# Altium project CPUBoard-v6.PrjPCB
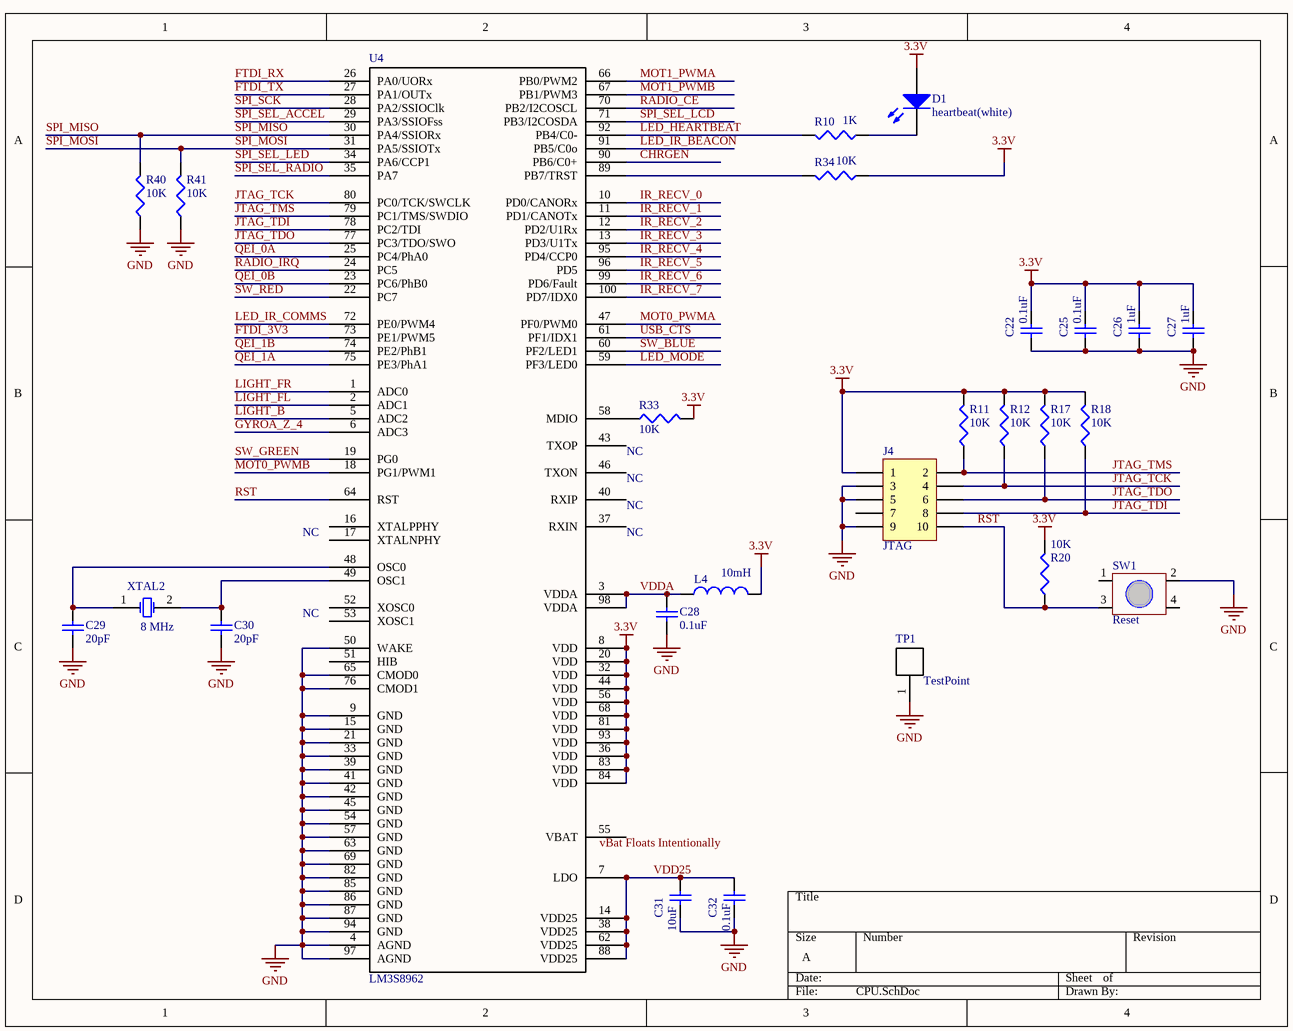
[diagram p0: CPU.SchDoc]
4 sheets, 108 parts. Net scope: global (net labels, ports and power ports of the same name join across sheets).
Board file: cpuPCB-v6.PcbDoc
Sheets:
  CPU.SchDoc
  USB_Headers.SchDoc
  IRComms.SchDoc
  LEDs.SchDoc

## Sheet CPU.SchDoc
size A

### Parts
C22  value 0.1uF  [CAPC1005L]  (hidden comment: Cap Semi)
C25  value 0.1uF  [CAPC1005L]  (hidden comment: Cap Semi)
C26  value 1uF  [CAPC1608L]  (hidden comment: Cap Semi)
C27  value 1uF  [CAPC1608L]  (hidden comment: Cap Semi)
C28  value 0.1uF  [CAPC1005L]  (hidden comment: Cap Semi)
C29  value 20pF  [CAPC1005L]  (hidden comment: Cap Semi)
C30  value 20pF  [CAPC1005L]  (hidden comment: Cap Semi)
C31  value 10uF  [CAPC1608L]  (hidden comment: Cap Semi)
C32  value 0.1uF  [CAPC1005L]  (hidden comment: Cap Semi)
D1  heartbeat(white)  [INDC2012L]
J4  JTAG  [JTAG-10]
L4  value 10mH  [INDC2012L]  (hidden comment: Inductor)
R10  value 1K  [RESC1608L]  (hidden comment: Res3)
R11  value 10K  [RESC1608L]  (hidden comment: Res3)
R12  value 10K  [RESC1608L]  (hidden comment: Res3)
R17  value 10K  [RESC1608L]  (hidden comment: Res3)
R18  value 10K  [RESC1608L]  (hidden comment: Res3)
R20  value 10K  [RESC1608L]  (hidden comment: Res3)
R33  value 10K  [RESC1608L]  (hidden comment: Res3)
R34  value 10K  [RESC1608L]  (hidden comment: Res3)
R40  value 10K  [RESC1608L]  (hidden comment: Res3)
R41  value 10K  [RESC1608L]  (hidden comment: Res3)
SW1  Reset  [SwitchTall-TL330]
TP1  TestPoint  [TestPoint]
U4  LM3S8962  [LQFP-100]
XTAL2  8 MHz  [RESC5025L]

### Nets
3.3V: C22.2 C25.2 C26.2 C27.2 D1.1(A) J4.1 L4.2 R11.2 R12.2 R17.2 R18.2 R20.2 R33.2 R34.1 U4.8(VDD) U4.20(VDD) U4.32(VDD) U4.36(VDD) U4.44(VDD) U4.56(VDD) U4.68(VDD) U4.81(VDD) U4.83(VDD) U4.84(VDD) U4.93(VDD)
GND: C22.1 C25.1 C26.1 C27.1 C28.1 C29.1 C30.1 C31.1 C32.1 J4.3 J4.5 J4.9 R40.1 R41.1 SW1.2 TP1.1 U4.4(AGND) U4.9(GND) U4.15(GND) U4.21(GND) U4.33(GND) U4.39(GND) U4.41(GND) U4.42(GND) U4.45(GND) U4.50(WAKE) U4.54(GND) U4.57(GND) U4.63(GND) U4.65(CMOD0) U4.69(GND) U4.76(CMOD1) U4.82(GND) U4.85(GND) U4.86(GND) U4.87(GND) U4.94(GND) U4.97(AGND)
CHRGEN: U4.90(PB6/C0+)
FTDI_3V3: U4.73(PE1/PWM5)
FTDI_RX: U4.26(PA0/UORx)
FTDI_TX: U4.27(PA1/OUTx)
GYROA_Z_4: U4.6(ADC3)
IR_RECV_0: U4.10(PD0/CANORx)
IR_RECV_1: U4.11(PD1/CANOTx)
IR_RECV_2: U4.12(PD2/U1Rx)
IR_RECV_3: U4.13(PD3/U1Tx)
IR_RECV_4: U4.95(PD4/CCP0)
IR_RECV_5: U4.96(PD5)
IR_RECV_6: U4.99(PD6/Fault)
IR_RECV_7: U4.100(PD7/IDX0)
JTAG_TCK: J4.4 R12.1 U4.80(PC0/TCK/SWCLK)
JTAG_TDI: J4.8 R18.1 U4.78(PC2/TDI)
JTAG_TDO: J4.6 R17.1 U4.77(PC3/TDO/SWO)
JTAG_TMS: J4.2 R11.1 U4.79(PC1/TMS/SWDIO)
LED_HEARTBEAT: R10.2 U4.92(PB4/C0-)
LED_IR_BEACON: U4.91(PB5/C0o)
LED_IR_COMMS: U4.72(PE0/PWM4)
LED_MODE: U4.59(PF3/LED0)
LIGHT_B: U4.5(ADC2)
LIGHT_FL: U4.2(ADC1)
LIGHT_FR: U4.1(ADC0)
MOT0_PWMA: U4.47(PF0/PWM0)
MOT0_PWMB: U4.18(PG1/PWM1)
MOT1_PWMA: U4.66(PB0/PWM2)
MOT1_PWMB: U4.67(PB1/PWM3)
QEI_0A: U4.25(PC4/PhA0)
QEI_0B: U4.23(PC6/PhB0)
QEI_1A: U4.75(PE3/PhA1)
QEI_1B: U4.74(PE2/PhB1)
RADIO_CE: U4.70(PB2/I2COSCL)
RADIO_IRQ: U4.24(PC5)
RST: J4.10 R20.1 SW1.3 U4.64(RST)
SPI_MISO: R40.2 U4.30(PA4/SSIORx)
SPI_MOSI: R41.2 U4.31(PA5/SSIOTx)
SPI_SCK: U4.28(PA2/SSIOClk)
SPI_SEL_ACCEL: U4.29(PA3/SSIOFss)
SPI_SEL_LCD: U4.71(PB3/I2COSDA)
SPI_SEL_LED: U4.34(PA6/CCP1)
SPI_SEL_RADIO: U4.35(PA7)
SW_BLUE: U4.60(PF2/LED1)
SW_GREEN: U4.19(PG0)
SW_RED: U4.22(PC7)
USB_CTS: U4.61(PF1/IDX1)
VDD25: C31.2 C32.2 U4.7(LDO) U4.14(VDD25) U4.38(VDD25) U4.62(VDD25) U4.88(VDD25)
VDDA: C28.2 L4.1 U4.3(VDDA) U4.98(VDDA)
NetC29_2: C29.2 U4.48(OSC0) XTAL2.1(OSC1)
NetC30_2: C30.2 U4.49(OSC1) XTAL2.2(OSC2)
NetD1_2: D1.2(K) R10.1
NetR33_1: R33.1 U4.58(MDIO)
NetR34_2: R34.2 U4.89(PB7/TRST)

Not connected (* = marked no-connect by the designer): J4 7; SW1 1 4; U4 16(XTALPPHY) 17(XTALNPHY) 37(RXIN) 40(RXIP) 43(TXOP) 46(TXON) 51(HIB) 52(XOSC0) 53(XOSC1) 55(VBAT)

### Notes on the sheet
- NC
- (near U4) NC
- (near U4) vBat Floats Intentionally

### Library data of the parts
C22 C25-C32 = Cap Semi: Capacitor (Semiconductor SIM Model); Published: 8-Jun-2000; LatestRevisionDate: 29-May-2009; LatestRevisionNote: IPC-7351 Footprint Added.; PackageReference: C1206; Publisher: Altium Limited; PackageDescription: Chip Capacitor
D1 = LED2: Typical RED, GREEN, YELLOW, AMBER GaAs LED; Published: 8-Jun-2000; LatestRevisionDate: 17-Jul-2002; LatestRevisionNote: Re-released for DXP Platform.; PackageVersion: Feb-2002; PackageReference: 3.2X1.6X1.1; Publisher: Altium Limited
J4 = Header 5X2H: Header, 5-Pin, Dual row, Right Angle; LatestRevisionDate: 17-Jul-2002; LatestRevisionNote: Re-released for DXP Platform.; Publisher: Altium Limited
L4 = Inductor: Code_IEC: 1005; Published: 8-Jun-2000; LatestRevisionDate: 29-May-2009; LatestRevisionNote: IPC-7351 Footprint Added.; PackageReference: 0402-A; Publisher: Altium Limited; PackageDescription: Chip Inductor; Code_JEITA: 0402
R10-R12 R17 R18 R20 R33 R34 R40 R41 = Res3: Resistor; Published: 8-Jun-2000; LatestRevisionDate: 29-May-2009; LatestRevisionNote: IPC-7351 Footprint Added.; PackageReference: J1-0603; Publisher: Altium Limited; PackageDescription: Chip Resistor
SW1 = Switch-TL330
XTAL2 = XTAL: Crystal Oscillator; Published: 8-Jun-2000; LatestRevisionDate: 17-Jul-2002; LatestRevisionNote: Re-released for DXP Platform.; PackageReference: R38; Publisher: Altium Limited

## Sheet USB_Headers.SchDoc
size A
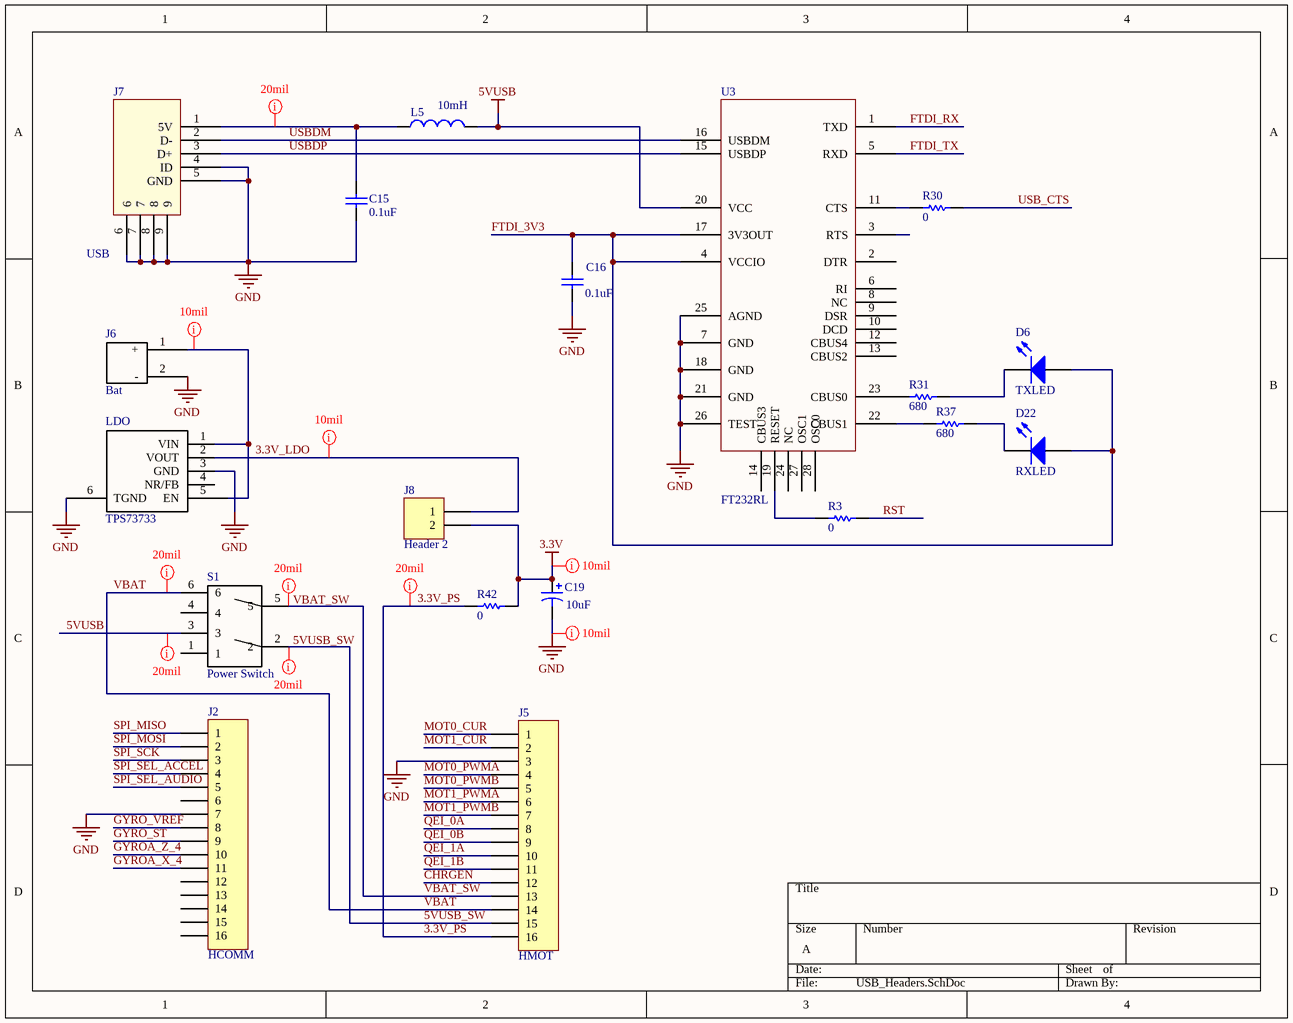
[diagram p1: USB_Headers.SchDoc]

### Parts
C15  value 0.1uF  [CAPC1005L]
C16  value 0.1uF  [CAPC1005L]
C19  value 10uF  [CAPC3216L]  (hidden comment: Cap Pol3)
D6  TXLED  [INDC2012L]
D22  RXLED  [INDC2012L]
J2  HCOMM  [HDR1X16]
J5  HMOT  [HDR1X16]
J6  Bat  [BatteryConnJST]
J7  USB  [USB Minib (thru-hole)]
J8  Header 2  [HDR1X2]
L5  value 10mH  [INDC2012L]  (hidden comment: Inductor)
LDO  TPS73733  [SOT-223-5pin]
R3  value 0  [RESC1608L]
R30  value 0  [RESC1608L]
R31  value 680  [RESC1608L]
R37  value 680  [RESC1608L]
R42  value 0  [RESC3216L]
S1  Power Switch  [DPDTSwitch]
U3  FT232RL  [SSOP-28]

### Nets
3.3V: C19.1 J8.2 R42.2
5VUSB: L5.2 S1.3 U3.20(VCC)
GND: C15.1 C16.1 C19.2 J2.7 J5.3 J6.2(-) J7.4(ID) J7.5(GND) J7.6 J7.7 J7.8 J7.9 LDO.3(GND) LDO.6(TGND) U3.7(GND) U3.18(GND) U3.21(GND) U3.25(AGND) U3.26(TEST)
3.3V_LDO: J8.1 LDO.2(VOUT)
3.3V_PS: J5.16 R42.1
5VUSB_SW: J5.15 S1.2
CHRGEN: J5.12
FTDI_3V3: C16.2 D6.1(A) D22.1(A) U3.4(VCCIO) U3.17(3V3OUT)
FTDI_RX: U3.1(TXD)
FTDI_TX: U3.5(RXD)
GYRO_ST: J2.9
GYRO_VREF: J2.8
GYROA_X_4: J2.11
GYROA_Z_4: J2.10
MOT0_CUR: J5.1
MOT0_PWMA: J5.4
MOT0_PWMB: J5.5
MOT1_CUR: J5.2
MOT1_PWMA: J5.6
MOT1_PWMB: J5.7
QEI_0A: J5.8
QEI_0B: J5.9
QEI_1A: J5.10
QEI_1B: J5.11
RST: R3.2
SPI_MISO: J2.1
SPI_MOSI: J2.2
SPI_SCK: J2.3
SPI_SEL_ACCEL: J2.4
SPI_SEL_AUDIO: J2.5
USB_CTS: R30.2
USBDM: J7.2(D-) U3.16(USBDM)
USBDP: J7.3(D+) U3.15(USBDP)
VBAT: J5.14 S1.6
VBAT_SW: J5.13 S1.5
NetC15_2: C15.2 J7.1(5V) L5.1
NetD6_2: D6.2(K) R31.2
NetD22_2: D22.2(K) R37.2
NetJ6_1: J6.1(+) LDO.1(VIN) LDO.5(EN)
NetR3_1: R3.1 U3.19(RESET)
NetR30_1: R30.1 U3.11(CTS)
NetR31_1: R31.1 U3.23(CBUS0)
NetR37_1: R37.1 U3.22(CBUS1)

Not connected (* = marked no-connect by the designer): J2 6 12 13 14 15 16; LDO 4(NR/FB); S1 1 4; U3 2(DTR) 3(RTS) 6(RI) 8(NC) 9(DSR) 10(DCD) 12(CBUS4) 13(CBUS2) 14(CBUS3) 24(NC) 27(OSC1) 28(OSC0)

### Layout directives
rule Width Constraint [Pref Width = 10mil    Min Width = 10mil    Max Width = 20mil]: 3.3V, 3.3V_PS, 5VUSB, 5VUSB_SW, GND, NetC15_2, VBAT, VBAT_SW
rule Width Constraint [Pref Width = 10mil    Min Width = 10mil    Max Width = 10mil]: 3.3V_LDO, NetJ6_1

### Notes on the sheet
- Labels drawn without touching a wire or pin: 5VUSB_SW, VBAT_SW

### Library data of the parts
C15 C16 = Cap: Capacitor; Published: 8-Jun-2000; LatestRevisionDate: 17-Jul-2002; LatestRevisionNote: Re-released for DXP Platform.; PackageReference: RAD-0.3; Publisher: Altium Limited
C19 = Cap Pol3: Polarized Capacitor (Surface Mount); Published: 8-Jun-2000; LatestRevisionDate: 29-May-2009; LatestRevisionNote: IPC-7351 Footprint Added.; PackageReference: C0805; Publisher: Altium Limited; PackageDescription: Chip Capacitor
D6 D22 = LED2: as D1 on sheet CPU; Published: 8-Jun-2000; LatestRevisionDate: 17-Jul-2002; LatestRevisionNote: Re-released for DXP Platform.; PackageVersion: Feb-2002; PackageReference: 3.2X1.6X1.1; Publisher: Altium Limited
J2 J5 = Header 16: Header, 16-Pin; LatestRevisionDate: 17-Jul-2002; LatestRevisionNote: Re-released for DXP Platform.; Publisher: Altium Limited
J6 = BatteryConnJST
J7 = USB-ConnTH
J8 = Header 2: Header, 2-Pin; LatestRevisionDate: 17-Jul-2002; LatestRevisionNote: Re-released for DXP Platform.; Publisher: Altium Limited
L5 = Inductor: Code_IEC: 1005; Published: 8-Jun-2000; LatestRevisionDate: 29-May-2009; LatestRevisionNote: IPC-7351 Footprint Added.; PackageReference: 0402-A; Publisher: Altium Limited; PackageDescription: Chip Inductor; Code_JEITA: 0402
LDO = LDO33-TI-TPS73733
R3 R30 R31 R37 R42 = Res1: Resistor; Published: 8-Jun-2000; LatestRevisionDate: 17-Jul-2002; LatestRevisionNote: Re-released for DXP Platform.; PackageReference: AXIAL-0.3; Publisher: Altium Limited
S1 = DPDTSwitch

## Sheet IRComms.SchDoc
size A
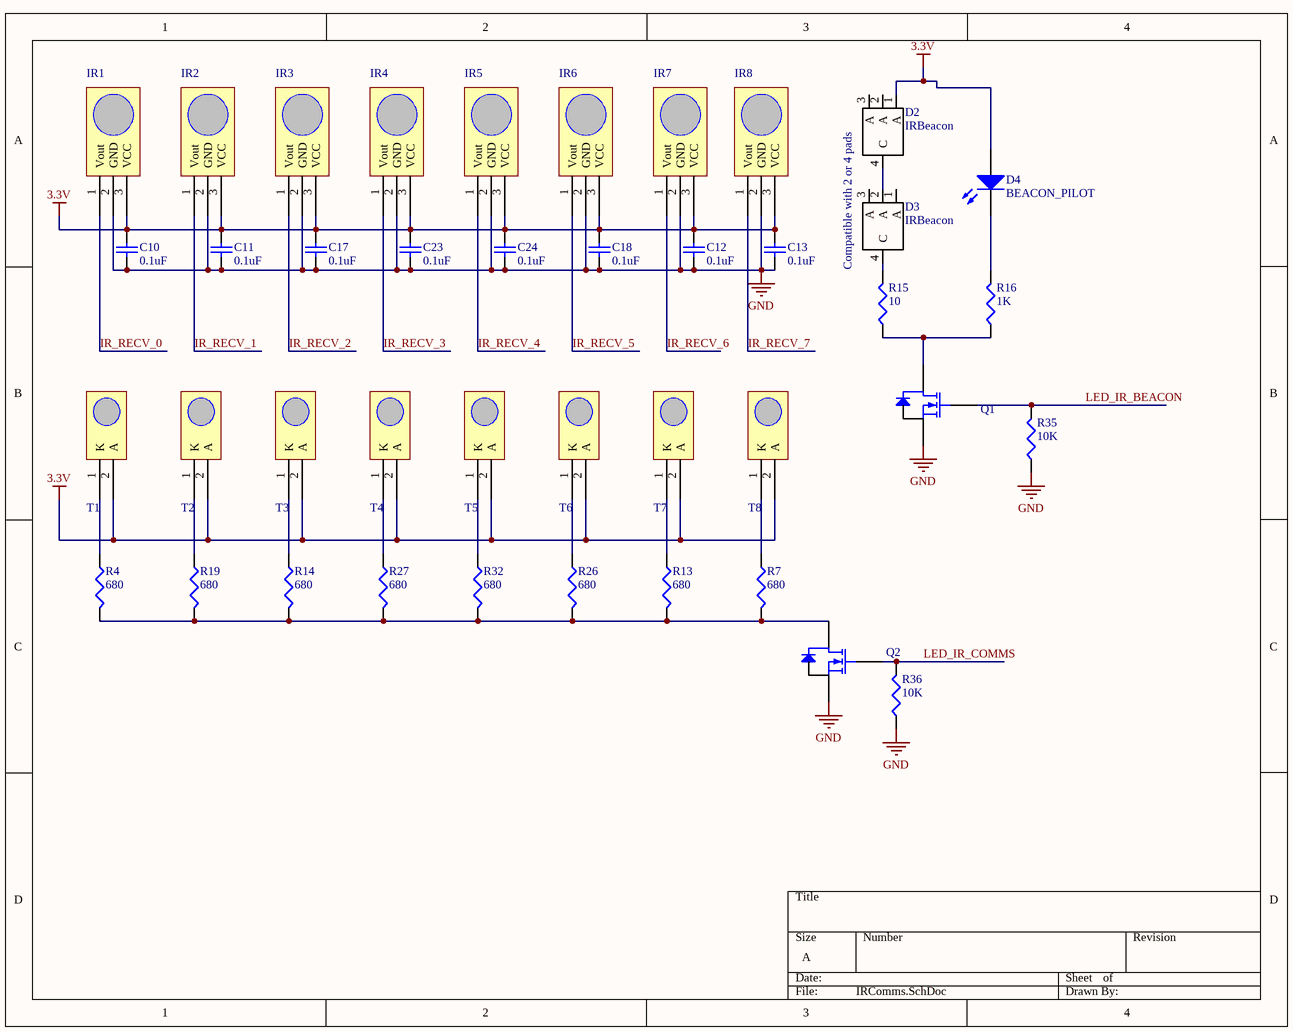
[diagram p2: IRComms.SchDoc]

### Parts
C10  value 0.1uF  [CAPC1005L]  (hidden comment: Cap Semi)
C11  value 0.1uF  [CAPC1005L]  (hidden comment: Cap Semi)
C12  value 0.1uF  [CAPC1005L]  (hidden comment: Cap Semi)
C13  value 0.1uF  [CAPC1005L]  (hidden comment: Cap Semi)
C17  value 0.1uF  [CAPC1005L]  (hidden comment: Cap Semi)
C18  value 0.1uF  [CAPC1005L]  (hidden comment: Cap Semi)
C23  value 0.1uF  [CAPC1005L]  (hidden comment: Cap Semi)
C24  value 0.1uF  [CAPC1005L]  (hidden comment: Cap Semi)
D2  IRBeacon  [IRBeacon]
D3  IRBeacon  [IRBeacon]
D4  BEACON_PILOT  [SurfaceMount(603)]
IR1  GP1UX31QS  [GP1UX31QS]  (value not drawn)
IR2  GP1UX31QS  [GP1UX31QS]  (value not drawn)
IR3  GP1UX31QS  [GP1UX31QS]  (value not drawn)
IR4  GP1UX31QS  [GP1UX31QS]  (value not drawn)
IR5  GP1UX31QS  [GP1UX31QS]  (value not drawn)
IR6  GP1UX31QS  [GP1UX31QS]  (value not drawn)
IR7  GP1UX31QS  [GP1UX31QS]  (value not drawn)
IR8  GP1UX31QS  [GP1UX31QS]  (value not drawn)
Q1  Mosfet  [SOT-23]  (value not drawn)
Q2  Mosfet  [SOT-23]  (value not drawn)
R4  value 680  [RESC1608L]  (hidden comment: Res3)
R7  value 680  [RESC1608L]  (hidden comment: Res3)
R13  value 680  [RESC1608L]  (hidden comment: Res3)
R14  value 680  [RESC1608L]  (hidden comment: Res3)
R15  value 10  [RESC1608L]  (hidden comment: Res3)
R16  value 1K  [RESC1608L]  (hidden comment: Res3)
R19  value 680  [RESC1608L]  (hidden comment: Res3)
R26  value 680  [RESC1608L]  (hidden comment: Res3)
R27  value 680  [RESC1608L]  (hidden comment: Res3)
R32  value 680  [RESC1608L]  (hidden comment: Res3)
R35  value 10K  [RESC1608L]  (hidden comment: Res3)
R36  value 10K  [RESC1608L]  (hidden comment: Res3)
T1  LN54  [LN54]  (value not drawn)
T2  LN54  [LN54]  (value not drawn)
T3  LN54  [LN54]  (value not drawn)
T4  LN54  [LN54]  (value not drawn)
T5  LN54  [LN54]  (value not drawn)
T6  LN54  [LN54]  (value not drawn)
T7  LN54  [LN54]  (value not drawn)
T8  LN54  [LN54]  (value not drawn)

### Nets
3.3V: C10.2 C11.2 C12.2 C13.2 C17.2 C18.2 C23.2 C24.2 D2.1(A) D4.1(A) IR1.3(VCC) IR2.3(VCC) IR3.3(VCC) IR4.3(VCC) IR5.3(VCC) IR6.3(VCC) IR7.3(VCC) IR8.3(VCC) T1.2(A) T2.2(A) T3.2(A) T4.2(A) T5.2(A) T6.2(A) T7.2(A) T8.2(A)
GND: C10.1 C11.1 C12.1 C13.1 C17.1 C18.1 C23.1 C24.1 IR1.2(GND) IR2.2(GND) IR3.2(GND) IR4.2(GND) IR5.2(GND) IR6.2(GND) IR7.2(GND) IR8.2(GND) Q1.2(S) Q2.2(S) R35.1 R36.1
IR_RECV_0: IR1.1(Vout)
IR_RECV_1: IR2.1(Vout)
IR_RECV_2: IR3.1(Vout)
IR_RECV_3: IR4.1(Vout)
IR_RECV_4: IR5.1(Vout)
IR_RECV_5: IR6.1(Vout)
IR_RECV_6: IR7.1(Vout)
IR_RECV_7: IR8.1(Vout)
LED_IR_BEACON: Q1.1(G) R35.2
LED_IR_COMMS: Q2.1(G) R36.2
NetD2_4: D2.4(C) D3.2(A)
NetD3_4: D3.4(C) R15.2
NetD4_2: D4.2(K) R16.2
NetQ1_3: Q1.3(D) R15.1 R16.1
NetQ2_3: Q2.3(D) R4.2 R7.2 R13.2 R14.2 R19.2 R26.2 R27.2 R32.2
NetR4_1: R4.1 T1.1(K)
NetR7_1: R7.1 T8.1(K)
NetR13_1: R13.1 T7.1(K)
NetR14_1: R14.1 T3.1(K)
NetR19_1: R19.1 T2.1(K)
NetR26_1: R26.1 T6.1(K)
NetR27_1: R27.1 T4.1(K)
NetR32_1: R32.1 T5.1(K)

Not connected (* = marked no-connect by the designer): D2 2(A) 3(A); D3 1(A) 3(A)

### Notes on the sheet
- Compatible with 2 or 4 pads

### Library data of the parts
C10-C13 C17 C18 C23 C24 = Cap Semi: Capacitor (Semiconductor SIM Model); Published: 8-Jun-2000; LatestRevisionDate: 29-May-2009; LatestRevisionNote: IPC-7351 Footprint Added.; PackageReference: C1206; Publisher: Altium Limited; PackageDescription: Chip Capacitor
D4 = LED
R4 R7 R13-R16 R19 R26 R27 R32 R35 R36 = Res3: Resistor; Published: 8-Jun-2000; LatestRevisionDate: 29-May-2009; LatestRevisionNote: IPC-7351 Footprint Added.; PackageReference: J1-0603; Publisher: Altium Limited; PackageDescription: Chip Resistor

## Sheet LEDs.SchDoc
size A
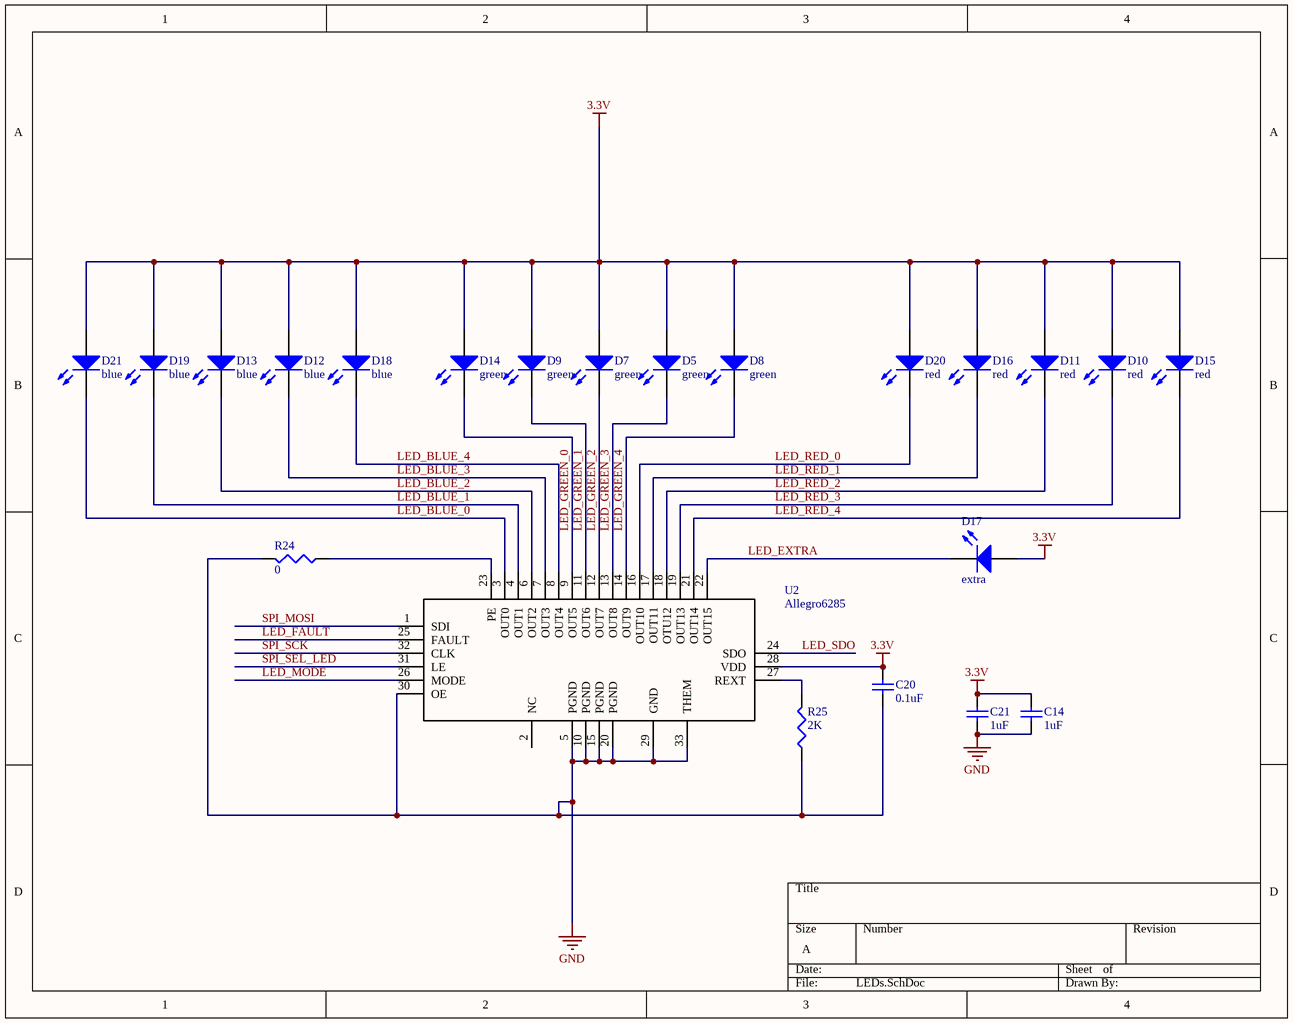
[diagram p3: LEDs.SchDoc]

### Parts
C14  value 1uF  [CAPC1608L]  (hidden comment: Cap Semi)
C20  value 0.1uF  [CAPC1005L]  (hidden comment: Cap Semi)
C21  value 1uF  [CAPC1608L]  (hidden comment: Cap Semi)
D5  green  [SurfaceMount(603)]
D7  green  [SurfaceMount(603)]
D8  green  [SurfaceMount(603)]
D9  green  [SurfaceMount(603)]
D10  red  [SurfaceMount(603)]
D11  red  [SurfaceMount(603)]
D12  blue  [SurfaceMount(603)]
D13  blue  [SurfaceMount(603)]
D14  green  [SurfaceMount(603)]
D15  red  [SurfaceMount(603)]
D16  red  [SurfaceMount(603)]
D17  extra  [SurfaceMount(603)]
D18  blue  [SurfaceMount(603)]
D19  blue  [SurfaceMount(603)]
D20  red  [SurfaceMount(603)]
D21  blue  [SurfaceMount(603)]
R24  value 0  [RESC1608L]  (hidden comment: Res3)
R25  value 2K  [RESC1608L]  (hidden comment: Res3)
U2  Allegro6285  [QFN-32]

### Nets
3.3V: C14.2 C20.2 C21.2 D5.1(A) D7.1(A) D8.1(A) D9.1(A) D10.1(A) D11.1(A) D12.1(A) D13.1(A) D14.1(A) D15.1(A) D16.1(A) D17.1(A) D18.1(A) D19.1(A) D20.1(A) D21.1(A) U2.28(VDD)
GND: C14.1 C20.1 C21.1 R24.2 R25.1 U2.5(PGND) U2.10(PGND) U2.15(PGND) U2.20(PGND) U2.29(GND) U2.30(OE) U2.33(THEM)
LED_BLUE_0: D21.2(K) U2.3(OUT0)
LED_BLUE_1: D19.2(K) U2.4(OUT1)
LED_BLUE_2: D13.2(K) U2.6(OUT2)
LED_BLUE_3: D12.2(K) U2.7(OUT3)
LED_BLUE_4: D18.2(K) U2.8(OUT4)
LED_EXTRA: D17.2(K) U2.22(OUT15)
LED_FAULT: U2.25(FAULT)
LED_GREEN_0: D14.2(K) U2.9(OUT5)
LED_GREEN_1: D9.2(K) U2.11(OUT6)
LED_GREEN_2: D7.2(K) U2.12(OUT7)
LED_GREEN_3: D5.2(K) U2.13(OUT8)
LED_GREEN_4: D8.2(K) U2.14(OUT9)
LED_MODE: U2.26(MODE)
LED_RED_0: D20.2(K) U2.16(OUT10)
LED_RED_1: D16.2(K) U2.17(OUT11)
LED_RED_2: D11.2(K) U2.18(OTU12)
LED_RED_3: D10.2(K) U2.19(OUT13)
LED_RED_4: D15.2(K) U2.21(OUT14)
LED_SDO: U2.24(SDO)
SPI_MOSI: U2.1(SDI)
SPI_SCK: U2.32(CLK)
SPI_SEL_LED: U2.31(LE)
NetR24_1: R24.1 U2.23(PE)
NetR25_2: R25.2 U2.27(REXT)

Not connected (* = marked no-connect by the designer): U2 2(NC)

### Library data of the parts
C14 C20 C21 = Cap Semi: Capacitor (Semiconductor SIM Model); Published: 8-Jun-2000; LatestRevisionDate: 29-May-2009; LatestRevisionNote: IPC-7351 Footprint Added.; PackageReference: C1206; Publisher: Altium Limited; PackageDescription: Chip Capacitor
D5 D7-D21 = LED
R24 R25 = Res3: Resistor; Published: 8-Jun-2000; LatestRevisionDate: 29-May-2009; LatestRevisionNote: IPC-7351 Footprint Added.; PackageReference: J1-0603; Publisher: Altium Limited; PackageDescription: Chip Resistor

## Nets that join several sheets
3.3V: CPU (25 pins), USB_Headers (C19.1 J8.2 R42.2), IRComms (26 pins), LEDs (20 pins)
GND: CPU (38 pins), USB_Headers (19 pins), IRComms (20 pins), LEDs (12 pins)
CHRGEN: CPU (U4.90), USB_Headers (J5.12)
FTDI_3V3: CPU (U4.73), USB_Headers (5 pins)
FTDI_RX: CPU (U4.26), USB_Headers (U3.1)
FTDI_TX: CPU (U4.27), USB_Headers (U3.5)
GYROA_Z_4: CPU (U4.6), USB_Headers (J2.10)
IR_RECV_0: CPU (U4.10), IRComms (IR1.1)
IR_RECV_1: CPU (U4.11), IRComms (IR2.1)
IR_RECV_2: CPU (U4.12), IRComms (IR3.1)
IR_RECV_3: CPU (U4.13), IRComms (IR4.1)
IR_RECV_4: CPU (U4.95), IRComms (IR5.1)
IR_RECV_5: CPU (U4.96), IRComms (IR6.1)
IR_RECV_6: CPU (U4.99), IRComms (IR7.1)
IR_RECV_7: CPU (U4.100), IRComms (IR8.1)
LED_IR_BEACON: CPU (U4.91), IRComms (Q1.1 R35.2)
LED_IR_COMMS: CPU (U4.72), IRComms (Q2.1 R36.2)
LED_MODE: CPU (U4.59), LEDs (U2.26)
MOT0_PWMA: CPU (U4.47), USB_Headers (J5.4)
MOT0_PWMB: CPU (U4.18), USB_Headers (J5.5)
MOT1_PWMA: CPU (U4.66), USB_Headers (J5.6)
MOT1_PWMB: CPU (U4.67), USB_Headers (J5.7)
QEI_0A: CPU (U4.25), USB_Headers (J5.8)
QEI_0B: CPU (U4.23), USB_Headers (J5.9)
QEI_1A: CPU (U4.75), USB_Headers (J5.10)
QEI_1B: CPU (U4.74), USB_Headers (J5.11)
RST: CPU (J4.10 R20.1 SW1.3 U4.64), USB_Headers (R3.2)
SPI_MISO: CPU (R40.2 U4.30), USB_Headers (J2.1)
SPI_MOSI: CPU (R41.2 U4.31), USB_Headers (J2.2), LEDs (U2.1)
SPI_SCK: CPU (U4.28), USB_Headers (J2.3), LEDs (U2.32)
SPI_SEL_ACCEL: CPU (U4.29), USB_Headers (J2.4)
SPI_SEL_LED: CPU (U4.34), LEDs (U2.31)
USB_CTS: CPU (U4.61), USB_Headers (R30.2)